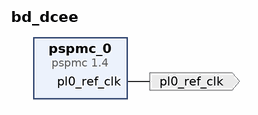
[diagram p0: block diagram of the top level]
# Vivado block design bd_dcee, xcvp1202-vsva2785-2MHP-e-S, Vivado 2023.2
create_bd_design bd_dcee

create_bd_port -dir O -type clk pl0_ref_clk
set_property -dict {CONFIG.FREQ_HZ 124998749} [get_bd_ports pl0_ref_clk]

create_bd_cell -type ip -vlnv xilinx.com:ip:pspmc:1.4 pspmc_0
